# EAGLE design protoBoardLogic (EAGLE 9.2.2)
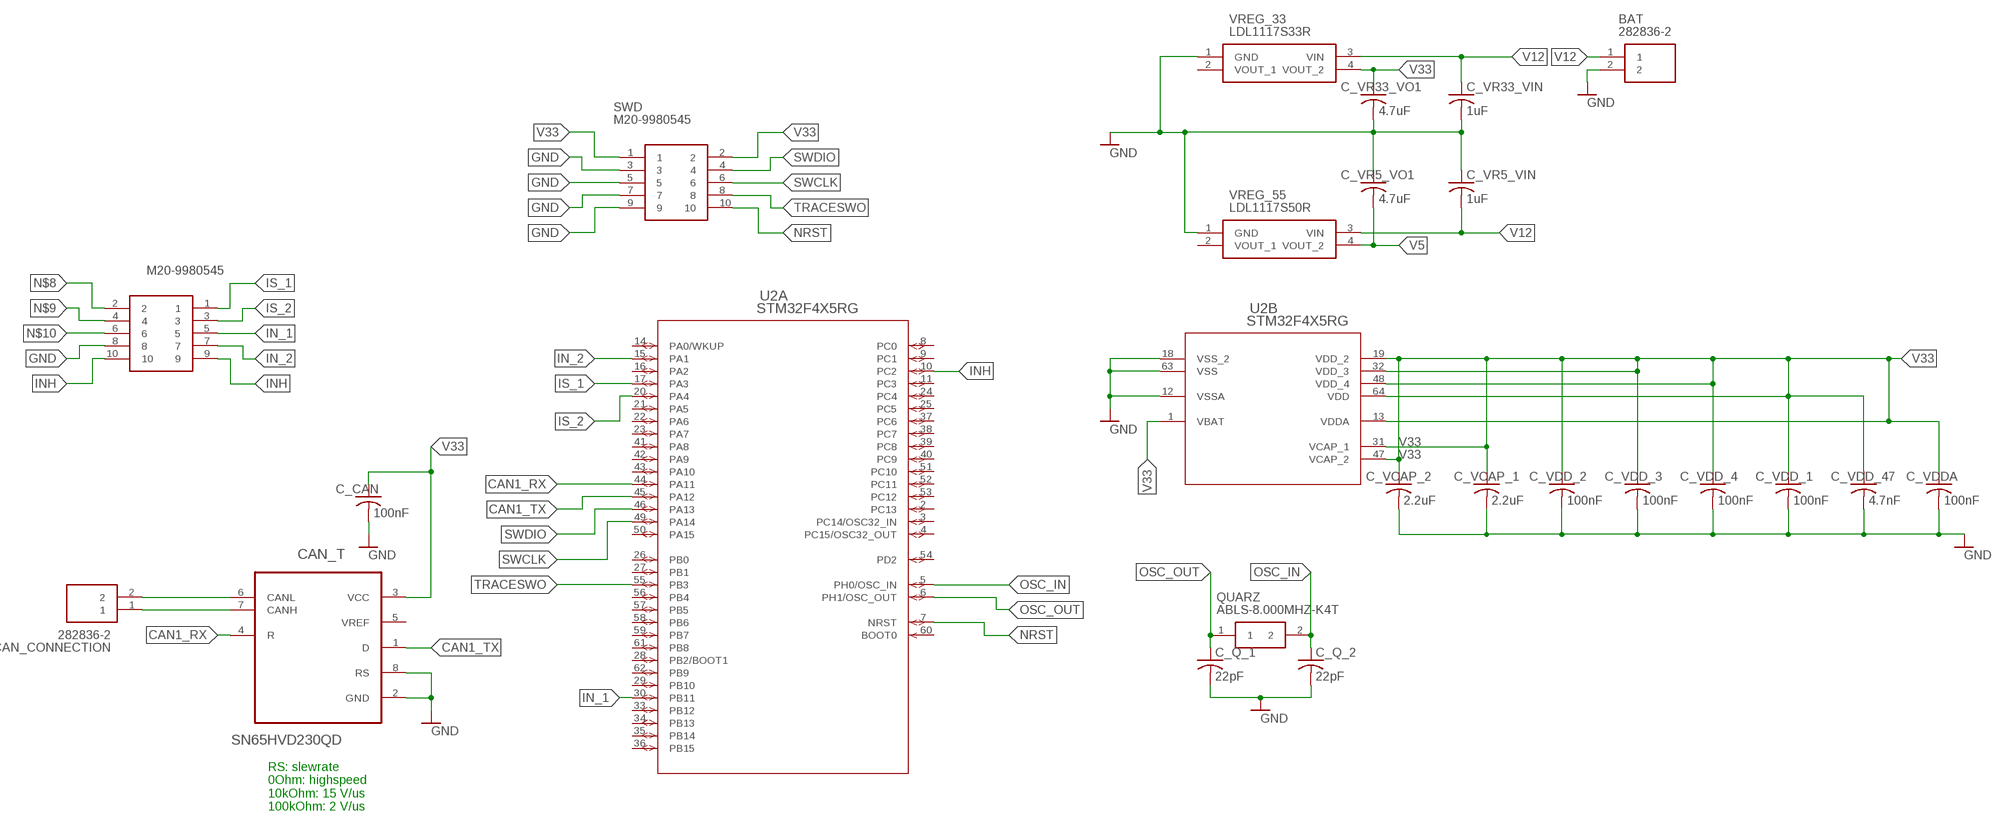
[diagram p0: schematic, sheet 1]

## Parts
BAT  282836-2  [SHDR2W100P0X500_1X2_1000X820X1]
C_CAN  100nF  C-USC1206  [C1206]
C_Q_1  22pF  C-USC0805  [C0805]
C_Q_2  22pF  C-USC0805  [C0805]
C_VCAP_1  2.2uF  C-USC1206  [C1206]
C_VCAP_2  2.2uF  C-USC1206  [C1206]
C_VDD_1  100nF  C-USC1206  [C1206]
C_VDD_2  100nF  C-USC1206  [C1206]
C_VDD_3  100nF  C-USC1206  [C1206]
C_VDD_4  100nF  C-USC1206  [C1206]
C_VDD_47  4.7nF  C-USC1206  [C1206]
C_VDDA  100nF  C-USC1206  [C1206]
C_VR5_VIN  1uF  C-USC1206  [C1206]
C_VR5_VO1  4.7uF  C-USC1206  [C1206]
C_VR33_VIN  1uF  C-USC1206  [C1206]
C_VR33_VO1  4.7uF  C-USC1206  [C1206]
CAN_CONNECTION  282836-2  [SHDR2W100P0X500_1X2_1000X820X1]
CAN_T  SN65HVD230QD  [SOIC127P600X175-8N]
HB_ST  M20-9980545  [HDRV10W80P254_2X5_1270X508X864]
QUARZ  ABLS-8.000MHZ-K4T  [ABLS-12.000MHZ-B2]
SWD  M20-9980545  [HDRV10W80P254_2X5_1270X508X864]
U2  STM32F4X5RG  [LQFP64-10X10MM]
VREG_33  LDL1117S33R  [SOT230P700X180-4N]
VREG_55  LDL1117S50R  [SOT230P700X180-4N]

## Nets
CAN1_RX: CAN_T.4(R) U2.44(A:PA11)
CAN1_TX: CAN_T.1(D) U2.45(A:PA12)
CANH: CAN_CONNECTION.1 CAN_T.7(CANH)
CANL: CAN_CONNECTION.2 CAN_T.6(CANL)
GND: BAT.2 C_CAN.2 C_Q_1.2 C_Q_2.2 C_VCAP_1.2 C_VCAP_2.2 C_VDD_1.2 C_VDD_2.2 C_VDD_3.2 C_VDD_4.2 C_VDD_47.2 C_VDDA.2 C_VR5_VIN.1 C_VR5_VO1.1 C_VR33_VIN.2 C_VR33_VO1.2 CAN_T.2(GND) CAN_T.8(RS) HB_ST.8 SWD.3 SWD.5 SWD.7 SWD.9 U2.12(B:VSSA) U2.18(B:VSS_2) U2.63(B:VSS) VREG_33.1(GND) VREG_55.1(GND)
IN_1: HB_ST.5 U2.30(A:PB11)
IN_2: HB_ST.7 U2.15(A:PA1)
INH: HB_ST.9 HB_ST.10 U2.10(A:PC2)
IS_1: HB_ST.1 U2.17(A:PA3)
IS_2: HB_ST.3 U2.20(A:PA4)
N$8: HB_ST.2
N$9: HB_ST.4
N$10: HB_ST.6
NRST: SWD.10 U2.7(A:NRST)
OSC_IN: C_Q_2.1 QUARZ.2 U2.5(A:PH0/OSC_IN)
OSC_OUT: C_Q_1.1 QUARZ.1 U2.6(A:PH1/OSC_OUT)
SWCLK: SWD.6 U2.49(A:PA14)
SWDIO: SWD.4 U2.46(A:PA13)
TRACESWO: SWD.8 U2.55(A:PB3)
V5: C_VR5_VO1.2 VREG_55.4(VOUT_2)
V12: BAT.1 C_VR5_VIN.2 C_VR33_VIN.1 VREG_33.3(VIN) VREG_55.3(VIN)
V33: C_CAN.1 C_VCAP_1.1 C_VCAP_2.1 C_VDD_1.1 C_VDD_2.1 C_VDD_3.1 C_VDD_4.1 C_VDD_47.1 C_VDDA.1 C_VR33_VO1.1 CAN_T.3(VCC) SWD.1 SWD.2 U2.1(B:VBAT) U2.13(B:VDDA) U2.19(B:VDD_2) U2.31(B:VCAP_1) U2.32(B:VDD_3) U2.47(B:VCAP_2) U2.48(B:VDD_4) U2.64(B:VDD) VREG_33.4(VOUT_2)
Unconnected: CAN_T.5(VREF) U2.2(A:PC13) U2.3(A:PC14/OSC32_IN) U2.4(A:PC15/OSC32_OUT) U2.8(A:PC0) U2.9(A:PC1) U2.11(A:PC3) U2.14(A:PA0/WKUP) U2.16(A:PA2) U2.21(A:PA5) U2.22(A:PA6) U2.23(A:PA7) U2.24(A:PC4) U2.25(A:PC5) U2.26(A:PB0) U2.27(A:PB1) U2.28(A:PB2/BOOT1) U2.29(A:PB10) U2.33(A:PB12) U2.34(A:PB13) U2.35(A:PB14) U2.36(A:PB15) U2.37(A:PC6) U2.38(A:PC7) U2.39(A:PC8) U2.40(A:PC9) U2.41(A:PA8) U2.42(A:PA9) U2.43(A:PA10) U2.50(A:PA15) U2.51(A:PC10) U2.52(A:PC11) U2.53(A:PC12) U2.54(A:PD2) U2.56(A:PB4) U2.57(A:PB5) U2.58(A:PB6) U2.59(A:PB7) U2.60(A:BOOT0) U2.61(A:PB8) U2.62(A:PB9) VREG_33.2(VOUT_1) VREG_55.2(VOUT_1)

## Notes on the sheet
- RS: slewrate
  0Ohm: highspeed
  10kOhm: 15 V/us
  100kOhm: 2 V/us

## Library data of the parts
BAT CAN_CONNECTION = SamacSys_Parts:282836-2: TERMINAL BLOCK, PCB MOUNT, SIDE WIRE ENTRY, STACKING , 5.00mm PITCH Source: Datasheet <http://www.mouser.com/datasheet/2/418/NG_CD_282836_H10-1248046.pdf>; DESCRIPTION: TERMINAL BLOCK, PCB MOUNT, SIDE WIRE ENTRY, STACKING , 5.00mm PITCH; HEIGHT: 10.2mm; MANUFACTURER_NAME: TE Connectivity; MANUFACTURER_PART_NUMBER: 282836-2; MOUSER_PART_NUMBER: 571-2828362
C_CAN C_Q_1 C_Q_2 C_VCAP_1 C_VCAP_2 C_VDD_1-C_VDD_4 C_VDD_47 C_VDDA C_VR5_VIN C_VR5_VO1 C_VR33_VIN C_VR33_VO1 = adafruit:C-US: CAPACITOR, American symbol
CAN_T = ADP_Components:SN65HVD230QD: 3.3-V CAN TRANSCEIVERS; MF: TEXAS INSTRUMENTS; MPN: SN65HVD230QD..; OC_FARNELL: 1648752; OC_NEWARK: 75C7746; PACKAGE: SOIC-8; SUPPLIER: Texas Instruments
HB_ST SWD = SamacSys_Parts:M20-9980545: M20 Header, Pin, Dil, Vertical, 5+5 W HARWIN M20 Series, 2.54mm Pitch 10 Way 2 Row Straight Pin Header, Through Hole, Solder Termination Source: Datasheet <http://www.mouser.com/datasheet/2/181/M20-998-1220570.pdf>; DESCRIPTION: M20 Header, Pin, Dil, Vertical, 5+5 W HARWIN M20 Series, 2.54mm Pitch 10 Way 2 Row Straight Pin Header, Through Hole, Solder Termination; HEIGHT: 8.64mm; MANUFACTURER_NAME: HARWIN; MANUFACTURER_PART_NUMBER: M20-9980545; MF: HARWIN; MOUSER_PART_NUMBER: 855-M20-9980545; MPN: M20-9980545; OC_FARNELL: 1022235
QUARZ = SamacSys_Parts:ABLS-8.000MHZ-K4T: ABRACON - ABLS-8.000MHZ-K4T - CRYSTAL, 8MHZ, 18PF, HC-49US Source: Datasheet <https://componentsearchengine.com/Datasheets/1/ABLS-8.000MHZ-K4T.pdf>; DESCRIPTION: ABRACON - ABLS-8.000MHZ-K4T - CRYSTAL, 8MHZ, 18PF, HC-49US; HEIGHT: mm; MANUFACTURER_NAME: ABRACON; MANUFACTURER_PART_NUMBER: ABLS-8.000MHZ-K4T; MF: ABRACON; MOUSER_PART_NUMBER: 815-ABLS-8.0MK4-T; MPN: ABLS-8.000MHZ-K4T; OC_FARNELL: 2467758
U2 = ADP_Components:STM32F4X5RG; MANUFACTURER_PART_NUMBER: STM32F4X5RG; OC_FARNELL: unknown; VENDOR: STMicroelectronics
VREG_33 = SamacSys_Parts:LDL1117S33R: STMICROELECTRONICS - LDL1117S33R - LDO, FIXED, 3.3V, 1.2A, SOT-223-3 Source: Datasheet <http://www.mouser.com/datasheet/2/389/ldl1117-1156241.pdf>; DESCRIPTION: STMICROELECTRONICS - LDL1117S33R - LDO, FIXED, 3.3V, 1.2A, SOT-223-3; HEIGHT: 1.8mm; MANUFACTURER_NAME: STMicroelectronics; MANUFACTURER_PART_NUMBER: LDL1117S33R; MF: STMICROELECTRONICS; MOUSER_PART_NUMBER: 511-LDL1117S33R; MPN: LDL1117S33R; OC_FARNELL: 2729708
VREG_55 = SamacSys_Parts:LDL1117S50R: STMICROELECTRONICS - LDL1117S50R - LDO, FIXED, 5V, 1.2A, SOT-223-3 Source: Datasheet <http://www.mouser.com/datasheet/2/389/ldl1117-1156241.pdf>; DESCRIPTION: STMICROELECTRONICS - LDL1117S50R - LDO, FIXED, 5V, 1.2A, SOT-223-3; HEIGHT: 1.8mm; MANUFACTURER_NAME: STMicroelectronics; MANUFACTURER_PART_NUMBER: LDL1117S50R; MF: STMICROELECTRONICS; MOUSER_PART_NUMBER: 511-LDL1117S50R; MPN: LDL1117S50R; OC_FARNELL: 2729709

## Net classes
0 default: width 0.2 mm, drill 0.5 mm

## Board
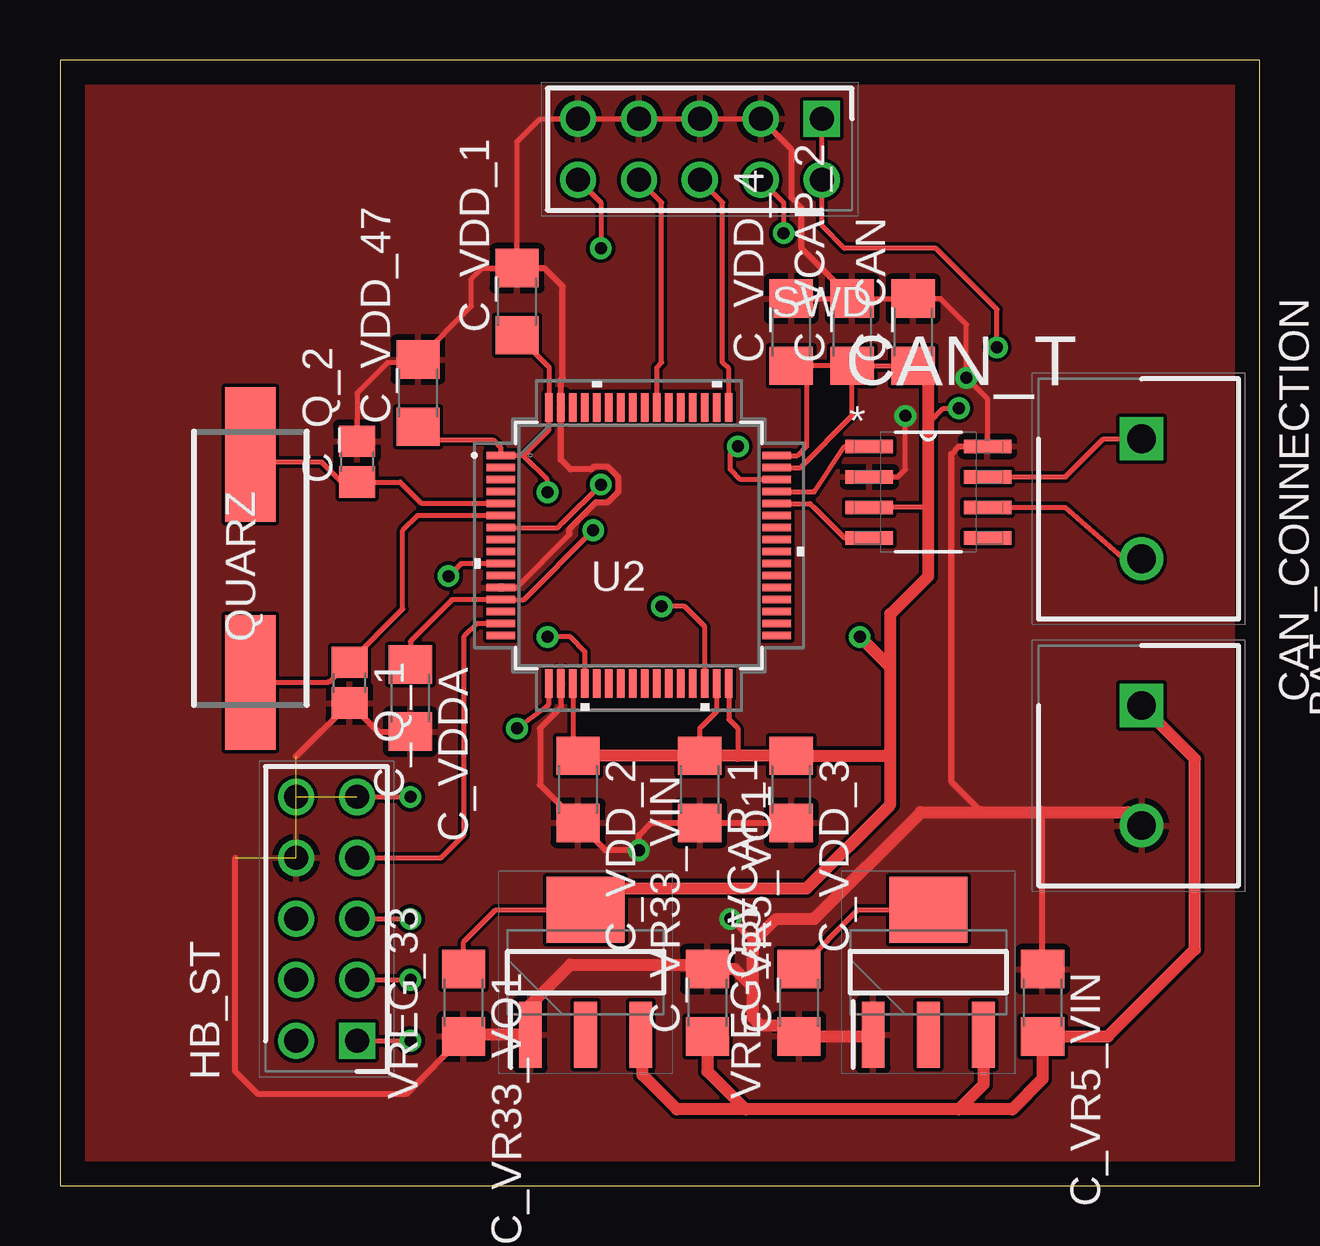
[diagram p1: board, top side]
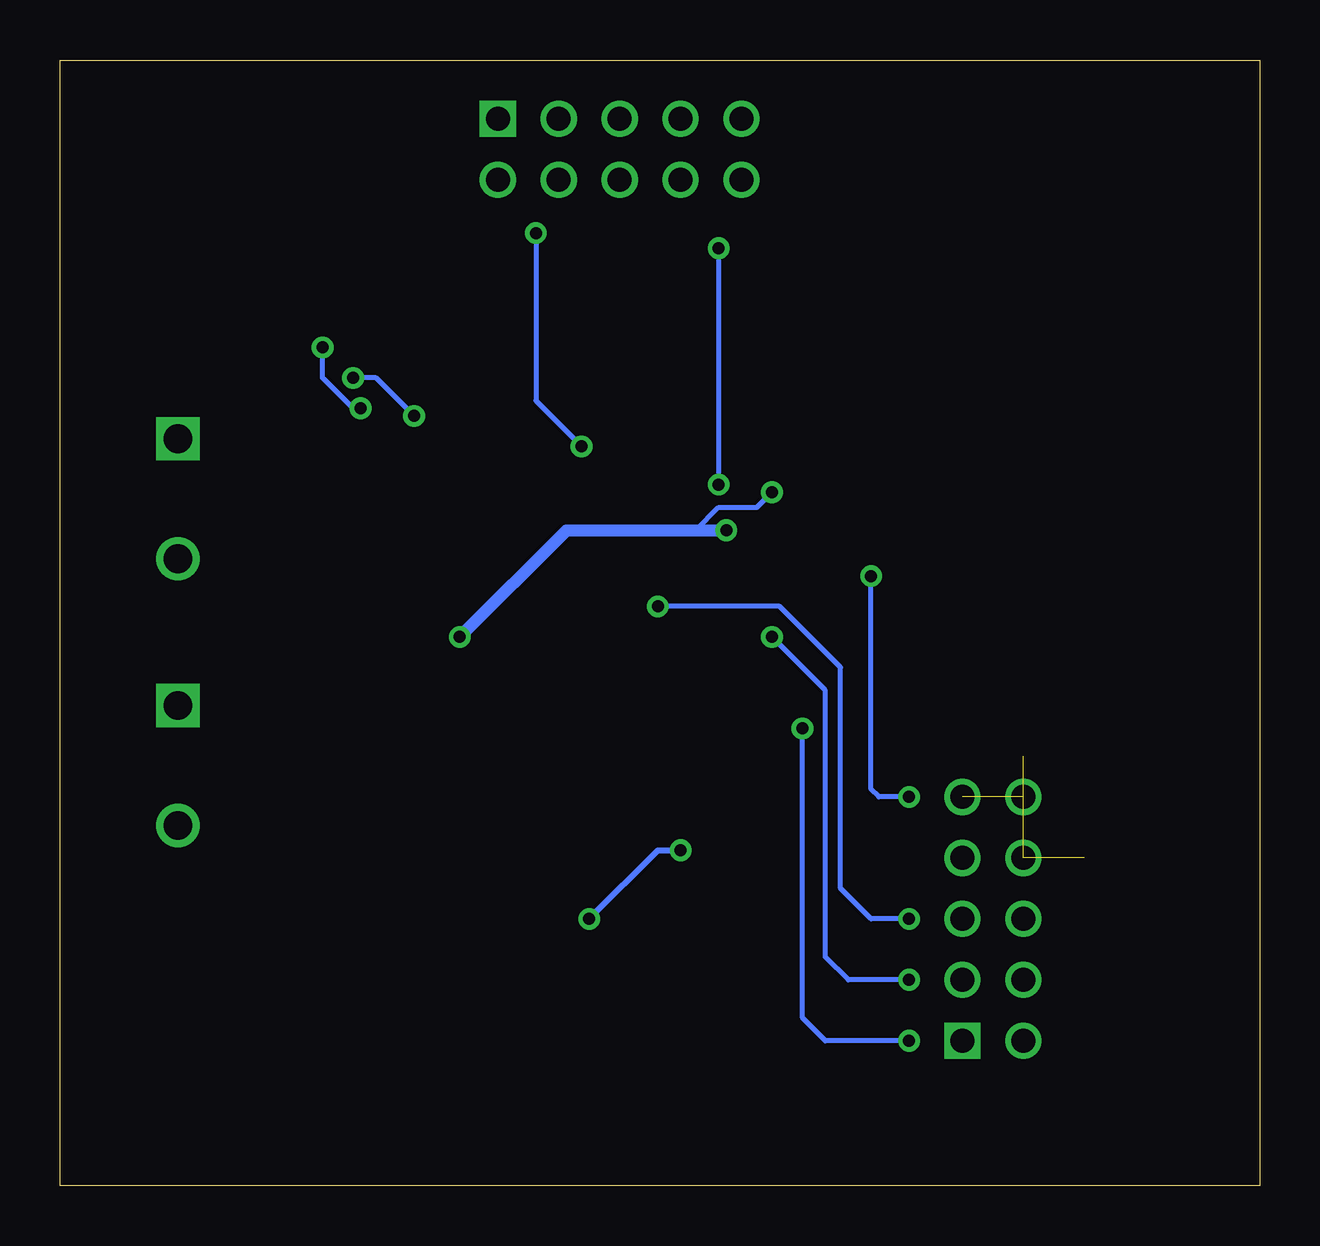
[diagram p2: board, bottom side, seen from below]

Size 50 x 46.9 mm. Coordinates in mm from the lower left corner, seen from the top.
Outline: 0,0 50,0 50,46.9 0,46.9 0,0
Copper layers (1*16): Top 0.035mm / dielectric 1.5mm / Bottom 0.035mm
Design rules "default": minimum track width 6mil, minimum drill 0.35mm, track to track 6mil, track to pad 6mil, pad to pad 6mil, via to via 6mil, smd to smd 6mil, copper to edge 40mil, drill to drill 6mil, minimum pad ring 10mil, minimum via ring 8mil, stop-mask expansion 4mil, vias tented up to drill 0mil, thermal gap 10mil

### Footprints (pad centres in the part's own frame; a part is rotated, then mirrored left to right if it is on the bottom)
SHDR2W100P0X500_1X2_1000X820X1 = drill 1.2 pad 1.8 square: 1 0,0 | drill 1.2 pad 1.8: 2 5,0
C1206 = smd 1.6 x 1.8: 1 -1.4,0; 2 1.4,0
C0805 = smd 1.3 x 1.5: 1 -0.85,0; 2 0.85,0
SOIC127P600X175-8N = smd 1.981 x 0.559: 1 -2.464,1.905; 2 -2.464,0.635; 3 -2.464,-0.635; 4 -2.464,-1.905; 5 2.464,-1.905; 6 2.464,-0.635; 7 2.464,0.635; 8 2.464,1.905
HDRV10W80P254_2X5_1270X508X864 = drill 1 pad 1.5 square: 1 0,0 | drill 1 pad 1.5: 2 0,2.54; 3 2.54,0; 4 2.54,2.54; 5 5.08,0; 6 5.08,2.54; 7 7.62,0; 8 7.62,2.54; 9 10.16,0; 10 10.16,2.54
ABLS-12.000MHZ-B2 = smd 5.6 x 2.1: 1 -4.75,0; 2 4.75,0
LQFP64-10X10MM = smd 1.194 x 0.305: 1 -5.75,3.75; 2 -5.75,3.25; 3 -5.75,2.75; 4 -5.75,2.25; 5 -5.75,1.75; 6 -5.75,1.25; 7 -5.75,0.75; 8 -5.75,0.25; 9 -5.75,-0.25; 10 -5.75,-0.75; 11 -5.75,-1.25; 12 -5.75,-1.75; 13 -5.75,-2.25; 14 -5.75,-2.75; 15 -5.75,-3.25; 16 -5.75,-3.75; 33 5.75,-3.75; 34 5.75,-3.25; 35 5.75,-2.75; 36 5.75,-2.25; 37 5.75,-1.75; 38 5.75,-1.25; 39 5.75,-0.75; 40 5.75,-0.25; 41 5.75,0.25; 42 5.75,0.75; 43 5.75,1.25; 44 5.75,1.75; 45 5.75,2.25; 46 5.75,2.75; 47 5.75,3.25; 48 5.75,3.75 | smd 0.305 x 1.194: 17 -3.75,-5.75; 18 -3.25,-5.75; 19 -2.75,-5.75; 20 -2.25,-5.75; 21 -1.75,-5.75; 22 -1.25,-5.75; 23 -0.75,-5.75; 24 -0.25,-5.75; 25 0.25,-5.75; 26 0.75,-5.75; 27 1.25,-5.75; 28 1.75,-5.75; 29 2.25,-5.75; 30 2.75,-5.75; 31 3.25,-5.75; 32 3.75,-5.75; 49 3.75,5.75; 50 3.25,5.75; 51 2.75,5.75; 52 2.25,5.75; 53 1.75,5.75; 54 1.25,5.75; 55 0.75,5.75; 56 0.25,5.75; 57 -0.25,5.75; 58 -0.75,5.75; 59 -1.25,5.75; 60 -1.75,5.75; 61 -2.25,5.75; 62 -2.75,5.75; 63 -3.25,5.75; 64 -3.75,5.75
SOT230P700X180-4N = smd 2.75 x 0.95: 1 -2.6,2.3; 2 -2.6,0; 3 -2.6,-2.3 | smd 2.75 x 3.25: 4 2.6,0

### Placement (x,y rotation side)
BAT  45.09,20 270 top
C_CAN  35.56,35.56 90 top
C_Q_1  12.06,20.95 270 top
C_Q_2  12.38,30.16 90 top
C_VCAP_1  26.67,16.51 270 top
C_VCAP_2  33.02,35.56 90 top
C_VDD_1  19.05,36.83 90 top
C_VDD_2  21.59,16.51 270 top
C_VDD_3  30.48,16.51 270 top
C_VDD_4  30.48,35.56 90 top
C_VDD_47  14.92,33.02 90 top
C_VDDA  14.61,20.32 270 top
C_VR5_VIN  40.96,7.62 270 top
C_VR5_VO1  30.8,7.62 90 top
C_VR33_VIN  26.99,7.62 90 top
C_VR33_VO1  16.83,7.62 270 top
CAN_CONNECTION  45.09,31.11 270 top
CAN_T  36.2,28.89 0 top
HB_ST  12.38,6.03 90 top
QUARZ  7.94,25.72 90 top
SWD  31.75,44.45 180 top
U2  24.13,26.67 0 top
VREG_33  21.91,8.89 90 top
VREG_55  36.2,8.89 90 top

### Tracks (layer width: path | path; a pad name or v marks a point on that pad's centre or on a via)
CAN1_RX
  Top 0.2: U2.44 31.27,28.42 31.43,28.26
  Top 0.203: 31.43,28.26 32.7,26.99 CAN_T.4
CAN1_TX
  Top 0.2: U2.45 31.41,28.92 31.43,28.89
  Top 0.203: 31.43,28.89 32.7,30.8 CAN_T.1
CANH
  Top 0.203: CAN_T.7 41.91,29.53 43.5,31.11 CAN_CONNECTION.1
CANL
  Top 0.203: CAN_T.6 41.91,28.26 44.45,26.04 CAN_CONNECTION.2
GND  (via drill 0.5)  (2 unrouted)
  Top 0.2: U2.12 19.02,24.92 21.23,27.13 | U2.18 20.88,19.93
  Top 0.203: C_VDD_4.2 C_VCAP_2.2 C_CAN.2 36.7,36.96 37.78,35.88 v37.78,33.66 38.66,32.78 CAN_T.8 | CAN_T.2 34.92,29.53 35.24,29.84 v35.24,32.07 | C_Q_2.2 12.38,33.02 13.65,34.29 14.79,34.29 C_VDD_47.2 17.14,36.64 17.14,37.78 17.59,38.23 C_VDD_1.2 19.05,43.5 20,44.45 SWD.9 SWD.7 SWD.5 SWD.3
  Top 0.254: C_VR5_VIN.1 40.96,15.56 | 28.89,10.16 v27.94,11.11 | C_VDD_3.2 C_VCAP_1.2 24.64,15.11 24.13,14.61 v24.13,13.97 22.73,13.97 C_VDD_2.2 20,16.7 20,19.05 20.88,19.93 | C_VDDA.2 13.25,18.92 C_Q_1.2 9.84,17.88 | C_VR33_VO1.2 14.42,3.81 8.26,3.81 7.3,4.76 7.3,13.65 | SWD.3 30.48,43.18 30.48,41.18 30.89,40.76 30.89,39.09 C_VCAP_2.2 | C_VDD_1.2 20.19,38.23 20.95,37.47 20.95,33.66 20.88,33.58 U2.63 20.88,30.24 21.27,29.84 22.14,29.84 22.24,29.94 22.85,29.94 23.27,29.51 23.27,28.91 22.85,28.48 22.35,28.48 21.23,27.36 21.23,27.13 | 38.42,15.56 37.15,16.83 37.15,30.48 37.47,30.8 CAN_T.8
  Top 0.508: VREG_55.1 33.83,6.22 C_VR5_VO1.1 30.35,6.67 29.21,6.67 28.89,6.99 28.89,8.26 | 28.89,8.26 28.13,9.02 C_VR33_VIN.2 26.8,9.21 21.27,9.21 19.61,7.54 VREG_33.1 17.52,6.29 17.46,6.35 17.33,6.22 C_VR33_VO1.2 | 28.89,8.26 28.89,10.16 29.84,11.11 31.43,11.11 35.88,15.56 38.42,15.56 40.96,15.56 44.53,15.56 BAT.2
  Bottom 0.203: v35.24,32.07 36.83,33.66 v37.78,33.66
  Bottom 0.254: v27.94,11.11 25.08,13.97 v24.13,13.97
  pour Top: -0.32,47.31 -0.32,-0.64 0.64,-1.59 50.8,-1.59 51.75,-0.64 51.75,47.94 0.32,47.94
IN_1  (via drill 0.5)
  Top 0.2: U2.30 26.88,23.29 26.04,24.13
  Top 0.203: HB_ST.5 v14.61,11.11 | 26.04,24.13 v25.08,24.13
  Bottom 0.203: v14.61,11.11 16.19,11.11 17.46,12.38 17.46,21.59 20,24.13 v25.08,24.13
IN_2
  Top 0.2: U2.15 17.39,23.42 16.83,22.86
  Top 0.203: 16.83,22.86 16.83,14.61 15.88,13.65 HB_ST.7
INH  (via drill 0.5)  (1 unrouted)
  Top 0.2: U2.10 16.71,25.92 v16.19,25.4
  Top 0.203: HB_ST.9 v14.61,16.19
  Bottom 0.203: v14.61,16.19 15.88,16.19 16.19,16.51 v16.19,25.4
IS_1  (via drill 0.5)
  Top 0.2: 20.32,20 20.38,20.06 U2.17
  Top 0.203: HB_ST.1 v14.61,6.03 | v19.05,19.05 20.32,20
  Bottom 0.203: v14.61,6.03 18.1,6.03 19.05,6.99 v19.05,19.05
IS_2  (via drill 0.5)
  Top 0.2: U2.20 21.88,22.25 21.27,22.86
  Top 0.203: HB_ST.3 v14.61,8.57 | 21.27,22.86 v20.32,22.86
  Bottom 0.203: v14.61,8.57 17.14,8.57 18.1,9.53 18.1,20.64 v20.32,22.86
NRST  (via drill 0.5)
  Top 0.2: U2.7 20.75,27.42 20.95,27.62
  Top 0.203: SWD.10 22.54,40.96 v22.54,39.05 | 20.95,27.62 v22.54,29.21
  Bottom 0.203: v22.54,39.05 v22.54,29.21
OSC_IN
  Top 0.2: U2.5 15.08,28.42
  Top 0.203: QUARZ.2 8.26,30.15 10.91,30.15 11.75,29.31 C_Q_2.1 14.19,29.31 15.08,28.42
OSC_OUT
  Top 0.2: U2.6 14.9,27.92
  Top 0.203: QUARZ.1 11.17,20.97 11.21,21.01 11.27,21.01 C_Q_1.1 14.29,24.03 14.29,27.3 14.9,27.92
SWCLK
  Top 0.2: U2.49 27.88,34.03 27.62,34.29
  Top 0.203: SWD.6 27.62,40.96 27.62,34.29
SWDIO  (via drill 0.5)
  Top 0.2: U2.46 28.36,29.42 27.94,29.84
  Top 0.203: SWD.4 30.16,40.96 v30.16,39.69 | v28.26,30.8 27.94,30.48 27.94,29.84
  Bottom 0.203: v30.16,39.69 30.16,32.7 v28.26,30.8
TRACESWO
  Top 0.2: U2.55 24.88,34.09 25.08,34.29
  Top 0.203: SWD.8 25.08,40.96 25.08,34.29
V5
  Top 0.203: C_VR5_VO1.2 33.27,11.49 VREG_55.4
V12
  Top 0.203: 24.28,6.22 VREG_33.3
  Top 0.508: BAT.1 47.31,17.78 47.31,9.84 43.69,6.22 C_VR5_VIN.2 40.96,4.45 39.69,3.17 37.47,3.17 | 37.47,3.17 28.57,3.17 | 28.57,3.17 25.72,3.17 24.28,4.62 24.28,6.22 | C_VR33_VIN.1 26.99,4.76 28.57,3.17 | VREG_55.3 38.49,4.21 37.47,3.17
V33  (via drill 0.5)
  Top 0.2: U2.47 30.87,29.92 | U2.19 21.38,18.12 | U2.31 27.38,19.76 26.67,19.05 C_VCAP_1.1 | U2.32 27.88,19.43 28.26,19.05 28.26,17.91 | U2.48 30.74,30.42 31.11,30.8 31.11,33.52 C_VDD_4.1
  Top 0.203: C_VDDA.1 14.61,22.67 16.35,24.42 U2.13 19.34,24.42 v22.23,27.3 | 21.38,18.12 C_VDD_2.1 | C_VCAP_1.1 26.92,18.16 | 29.4,17.91 C_VDD_3.1 | C_VDD_4.1 30.48,33.97 30.67,34.16 C_VCAP_2.1 | C_VCAP_2.1 33.02,32.07 30.87,29.92 | C_VCAP_2.1 C_CAN.1 | 36.2,28.26 CAN_T.3 | C_VDD_1.1 20.38,34.1 U2.64 20.38,31.49 19.31,30.42 | C_VDD_47.1 15.49,31.05 18.06,31.05 18.38,30.74 U2.1 19.31,30.42 | v20.32,28.89 20.32,29.41 19.31,30.42 | C_VR33_VO1.1 16.83,10.16 18.16,11.49 VREG_33.4 | 36.2,31.75 36.83,32.38 v37.47,32.38 | v39.05,34.92 39.05,36.51 36.51,39.05 32.7,39.05 31.75,40.01 SWD.2 SWD.1
  Top 0.508: VREG_33.4 22.8,12.38 31.11,12.38 34.61,15.88 34.61,18.1 | 34.61,18.1 34.61,21.59 | 34.61,21.59 34.61,23.81 36.2,25.4 36.2,28.26 36.2,31.75 36.2,33.52 C_CAN.1 | 34.61,18.1 34.42,17.91 C_VDD_3.1 28.26,17.91 27.18,17.91 26.92,18.16 | C_VCAP_1.1 C_VDD_2.1 | 34.61,21.59 v33.34,22.86
  Bottom 0.203: 23.5,27.3 22.54,28.26 20.95,28.26 v20.32,28.89 | v37.47,32.38 37.78,32.38 39.05,33.66 v39.05,34.92
  Bottom 0.508: v33.34,22.86 28.89,27.3 23.5,27.3 v22.23,27.3